# Altium schematic sheet 第五届省赛.SchDoc
size A4
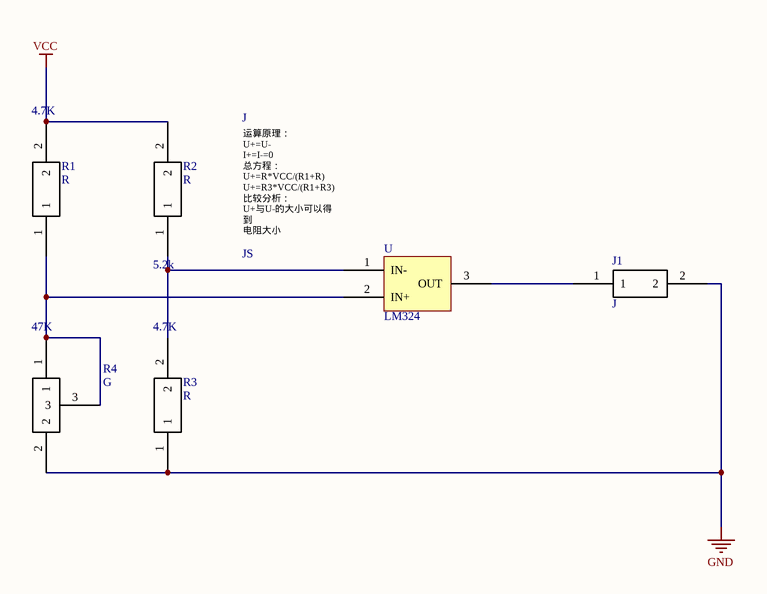
[diagram p0: 第五届省赛.SchDoc]

## Parts
J  JS
J1  J
R1  R
R2  R
R3  R
R4  G
U  LM324

## Nets
GND: J1.2 R3.1 R4.2
VCC: R1.2 R2.2 U.4(VCC) U.5(GND)
NetJ1_1: J1.1 U.3(OUT)
NetR1_1: R1.1 R4.1 R4.3 U.2(IN+)
NetR2_1: R2.1 R3.2 U.1(IN-)

## Notes on the sheet
- (in symbol G) 47K
- (in symbol JS) 运算原理： / U+=U- / I+=I-=0 / 总方程： / U+=R*VCC/(R1+R) / U+=R3*VCC/(R1+R3) / 比较分析： / U+与U-的大小可以得到 / 电阻大小
- (in symbol R) 4.7K; 5.2k